# EAGLE design CH340G_CAT-TR (EAGLE 7.2.0)
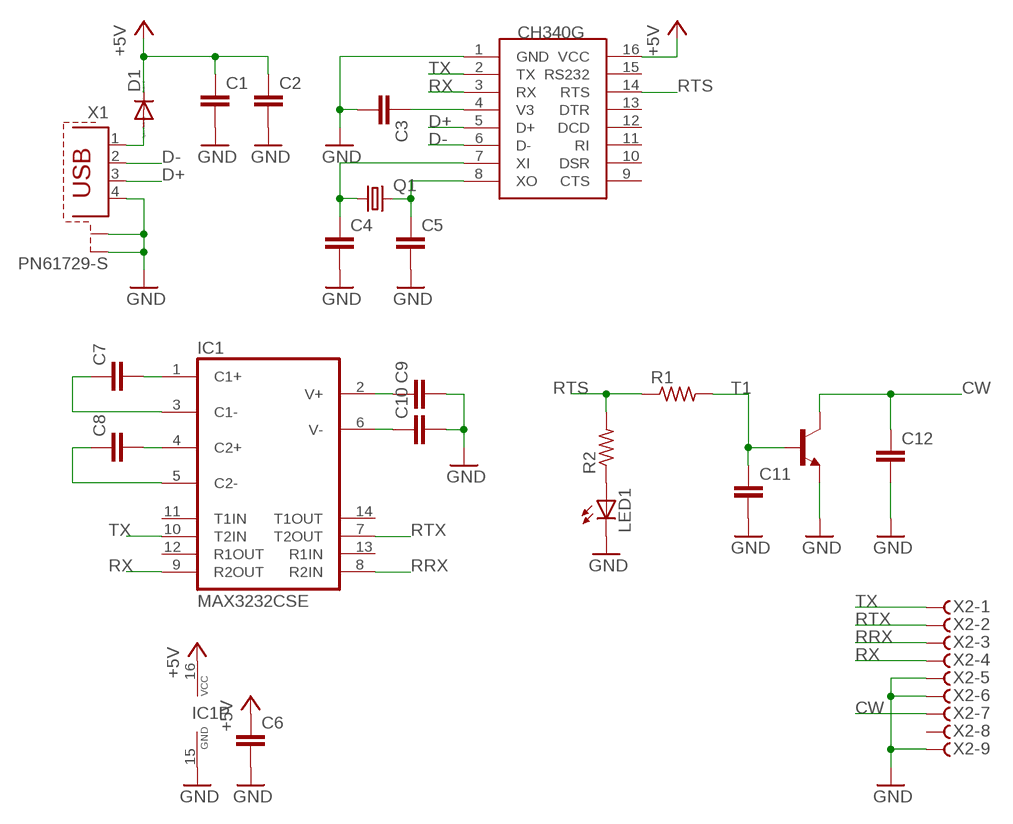
[diagram p0: schematic, sheet 1]

## Parts
C1  C-EUC0805K  [C0805K]
C2  C-EUC0805K  [C0805K]
C3  C-EUC0805K  [C0805K]
C4  C-EUC0805K  [C0805K]
C5  C-EUC0805K  [C0805K]
C6  C-EUC0805K  [C0805K]
C7  C-EUC0805K  [C0805K]
C8  C-EUC0805K  [C0805K]
C9  C-EUC0805K  [C0805K]
C10  C-EUC0805K  [C0805K]
C11  C-EUC0805K  [C0805K]
C12  C-EUC0805K  [C0805K]
D1  1N4148DO35-7  [DO35-7]
IC1  MAX3232CSE  [SO16]
LED1  LED3MM  [LED3MM]
Q1  CRYSTALHC49S  [HC49/S]
R1  R-US_M0805  [M0805]
R2  R-US_M0805  [M0805]
T1  BC548-NPN-TO92-CBE  [TO92-CBE]
U$1  CH340G  [SOIC16]
X1  PN61729-S  [PN61729-S]
X2  F09HPS  [F09HP]

## Nets
+5V: C1.1 C2.1 C6.1 D1.C IC1.16(VCC) U$1.16(VCC)
CW: C12.1 T1.C X2.7
D+: U$1.5(D+) X1.3
D-: U$1.6(D-) X1.2
GND: C1.2 C2.2 C3.2 C4.2 C5.2 C6.2 C9.2 C10.2 C11.2 C12.2 IC1.15(GND) LED1.K(C) T1.E U$1.1(GND) X1.4 X1.S1 X1.S2 X2.5 X2.6 X2.9
N$1: D1.A X1.1
N$2: C4.1 Q1.1 U$1.7(XI)
N$3: C5.1 Q1.2 U$1.8(XO)
N$4: C10.1 IC1.6(V-)
N$5: C3.1 U$1.4(V3)
N$6: C9.1 IC1.2(V+)
N$7: C8.2 IC1.4(C2+)
N$8: C7.2 IC1.1(C1+)
N$9: C7.1 IC1.3(C1-)
N$10: C8.1 IC1.5(C2-)
N$11: C11.1 R1.2 T1.B
N$12: LED1.A R2.1
RRX: IC1.8(R2IN) X2.3
RTS: R1.1 R2.2 U$1.14(RTS)
RTX: IC1.7(T2OUT) X2.2
RX: IC1.9(R2OUT) U$1.3(RX) X2.4
TX: IC1.10(T2IN) U$1.2(TX) X2.1
Unconnected: IC1.11(T1IN) IC1.12(R1OUT) IC1.13(R1IN) IC1.14(T1OUT) U$1.9(CTS) U$1.10(DSR) U$1.11(RI) U$1.12(DCD) U$1.13(DTR) U$1.15(RS232) X2.8

## Library data of the parts
C1-C12 = rcl:C-EU: CAPACITOR, European symbol
D1 = diode:1N4148: DIODE high speed (Philips)
IC1 = maxim:MAX3232*: True RS-232 Transceivers 3.0V to 5.5V, Low-Power up to 1Mbps, Using Four 0.1µF External Capacitors Source: http://pdfserv.maxim-ic.com/en/ds/MAX3222-MAX3241.pdf; MPN: MAX3232CSE; OC_FARNELL: 9725490; OC_NEWARK: 90C2890
LED1 = led:LED: LED OSRAM: - CHIPLED LG R971, LG N971, LY N971, LG Q971, LY Q971, LO R971, LY R971 LH N974, LH R974 LS Q976, LO Q976, LY Q976 LO Q996 - Hyper CHIPLED LW Q18S LB Q993, LB Q99A, LB R99A - SideLED LS A670, LO A670, LY A670, LG A670, LP A670 LB A673, LV A673, LT A673, LW A673 LH A674 LY A675 LS A676, LA A676, LO A676, LY A676, LW A676 LS A679, LY A679, LG A679 - Hyper Micro SIDELED® LS Y876, LA Y876, LO Y876, LY Y876 LT Y87S - SmartLED LW L88C, LW L88S LB L89C, LB L89S, LG L890 LS L89K, LO L89K, LY L89K LS L896, LA L896, LO L896, LY L896 - TOPLED LS T670, LO T670, LY T670, LG T670, LP T670 LSG T670, LSP T670, LSY T670, LOP T670, LYG T670 LG T671, LOG T671, LSG T671 LB T673, LV T673, LT T673, LW T673 LH T674 LS T676, LA T676, LO T676, LY T676, LB T676, LH T676, LSB T676, LW T676 LB T67C, LV T67C, LT T67C, LS T67K, LO T67K, LY T67K, LW E67C LS E67B, LA E67B, LO E67B, LY E67B, LB E67C, LV E67C, LT E67C LW T67C LS T679, LY T679, LG T679 LS T770, LO T770, LY T770, LG T770, LP T770 LB T773, LV T773, LT T773, LW T773 LH T774 LS E675, LA E675, LY E675, LS T675 LS T776, LA T776, LO T776, LY T776, LB T776 LHGB T686 LT T68C, LB T68C - Hyper Mini TOPLED® LB M676 - Mini TOPLED Santana® LG M470 LS M47K, LO M47K, LY M47K Source: http://www.osram.convergy.de LUXEON: - LUMILED® LXK2-PW12-R00, LXK2-PW12-S00, LXK2-PW14-U00, LXK2-PW14-V00 LXK2-PM12-R00, LXK2-PM12-S00, LXK2-PM14-U00 LXK2-PE12-Q00, LXK2-PE12-R00, LXK2-PE12-S00, LXK2-PE14-T00, LXK2-PE14-U00 LXK2-PB12-K00, LXK2-PB12-L00, LXK2-PB12-M00, LXK2-PB14-N00, LXK2-PB14-P00, LXK2-PB14-Q00 LXK2-PR12-L00, LXK2-PR12-M00, LXK2-PR14-Q00, LXK2-PR14-R00 LXK2-PD12-Q00, LXK2-PD12-R00, LXK2-PD12-S00 LXK2-PH12-R00, LXK2-PH12-S00 LXK2-PL12-P00, LXK2-PL12-Q00, LXK2-PL12-R00 Source: www.luxeon.com KINGBRIGHT: KA-3528ASYC Source: www.kingbright.com
Q1 = crystal:CRYSTAL: CRYSTAL; OC_FARNELL: 1667008; OC_NEWARK: unknown
R1 R2 = rcl:R-US_: RESISTOR, American symbol
T1 = transistor:*-NPN-: NPN Transistror BF959 corrected 2008.03.06
U$1 = ch340g:CH340G
X1 = con-berg:PN61729-S: BERG USB connector; OC_FARNELL: unknown; OC_NEWARK: unknown
X2 = con-subd:F09?S: SUB-D; OC_FARNELL: unknown; OC_NEWARK: unknown

## Board
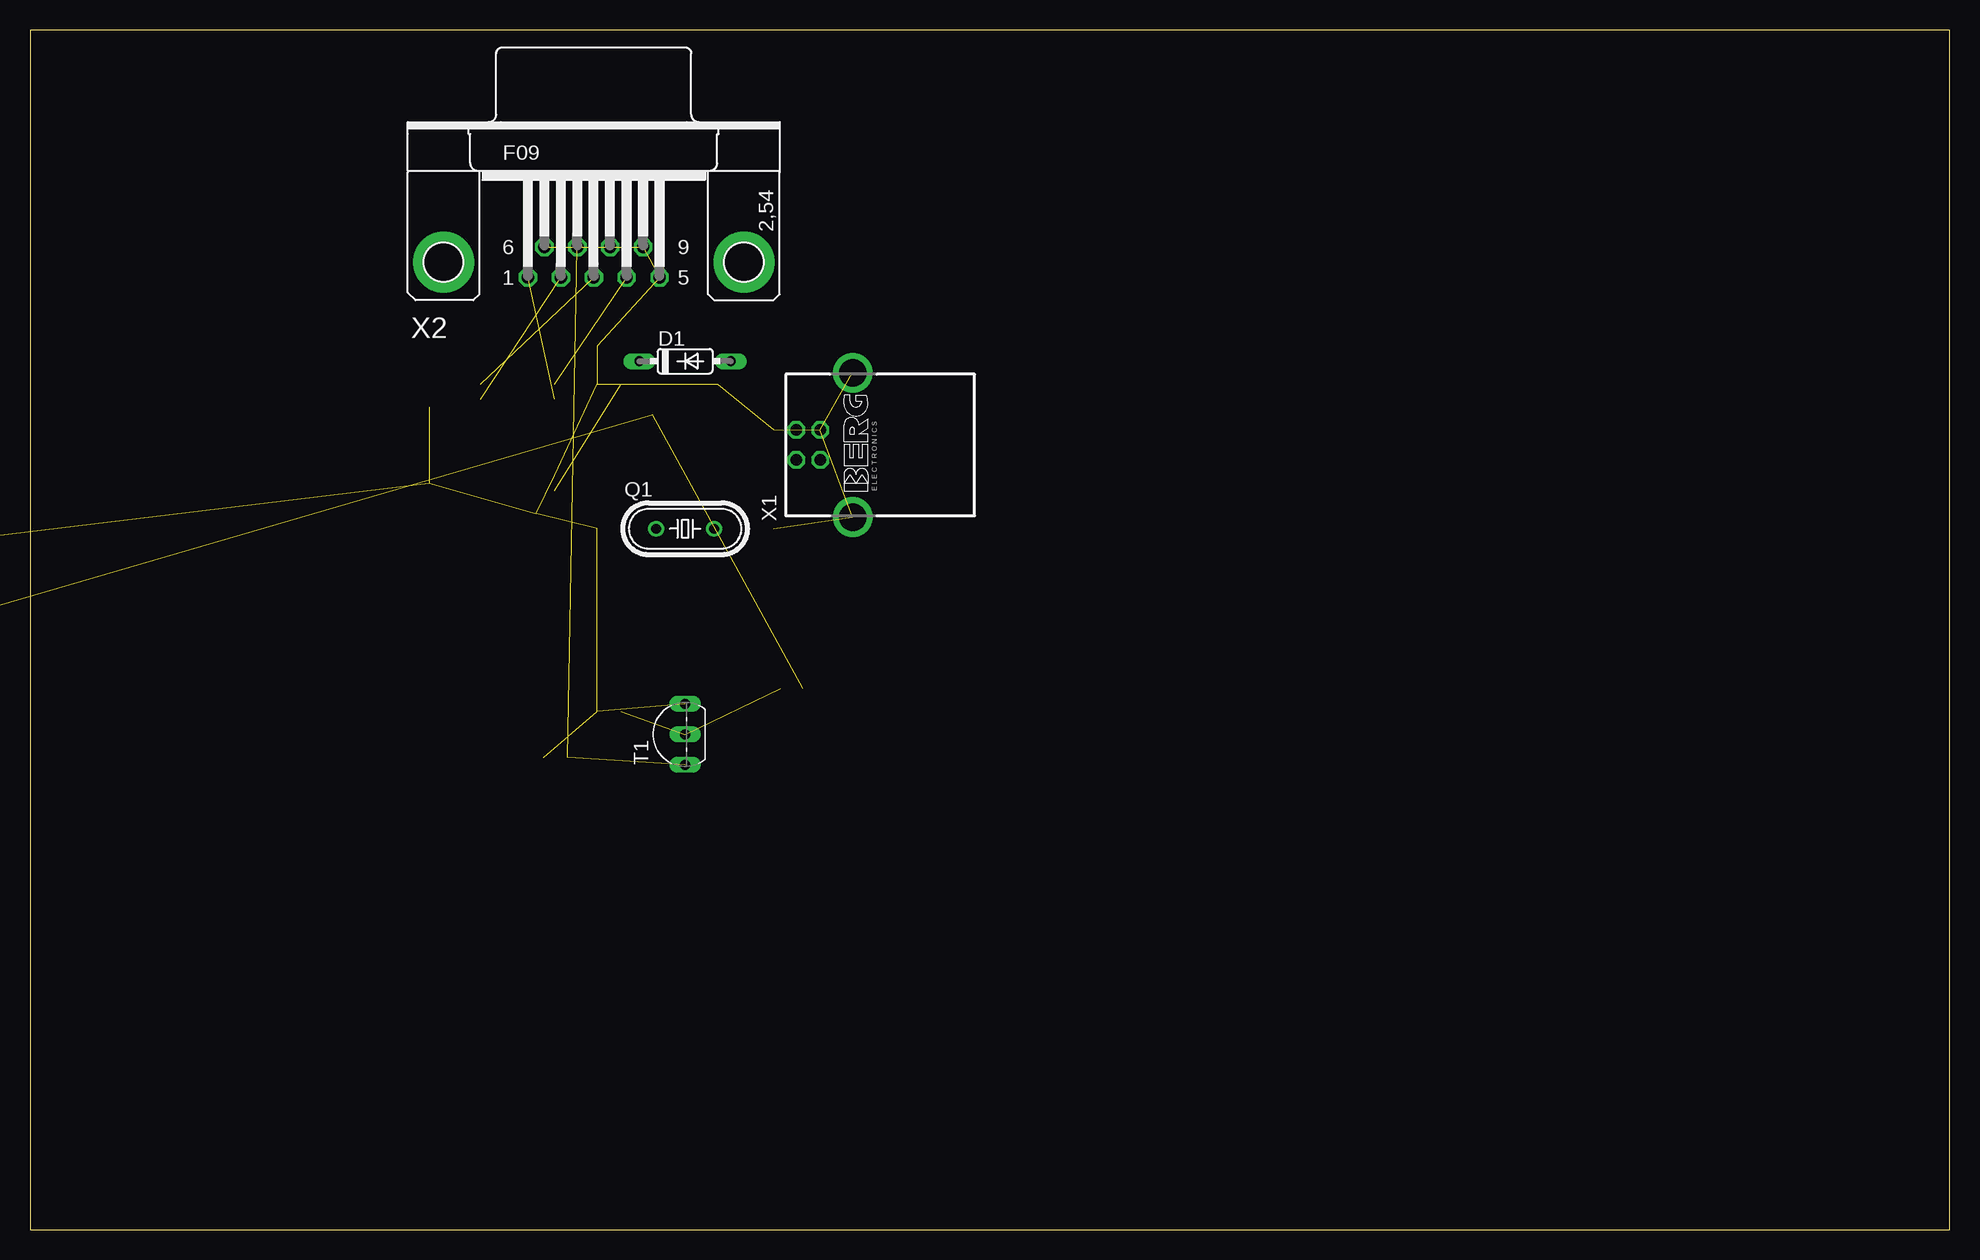
[diagram p1: board, top side]
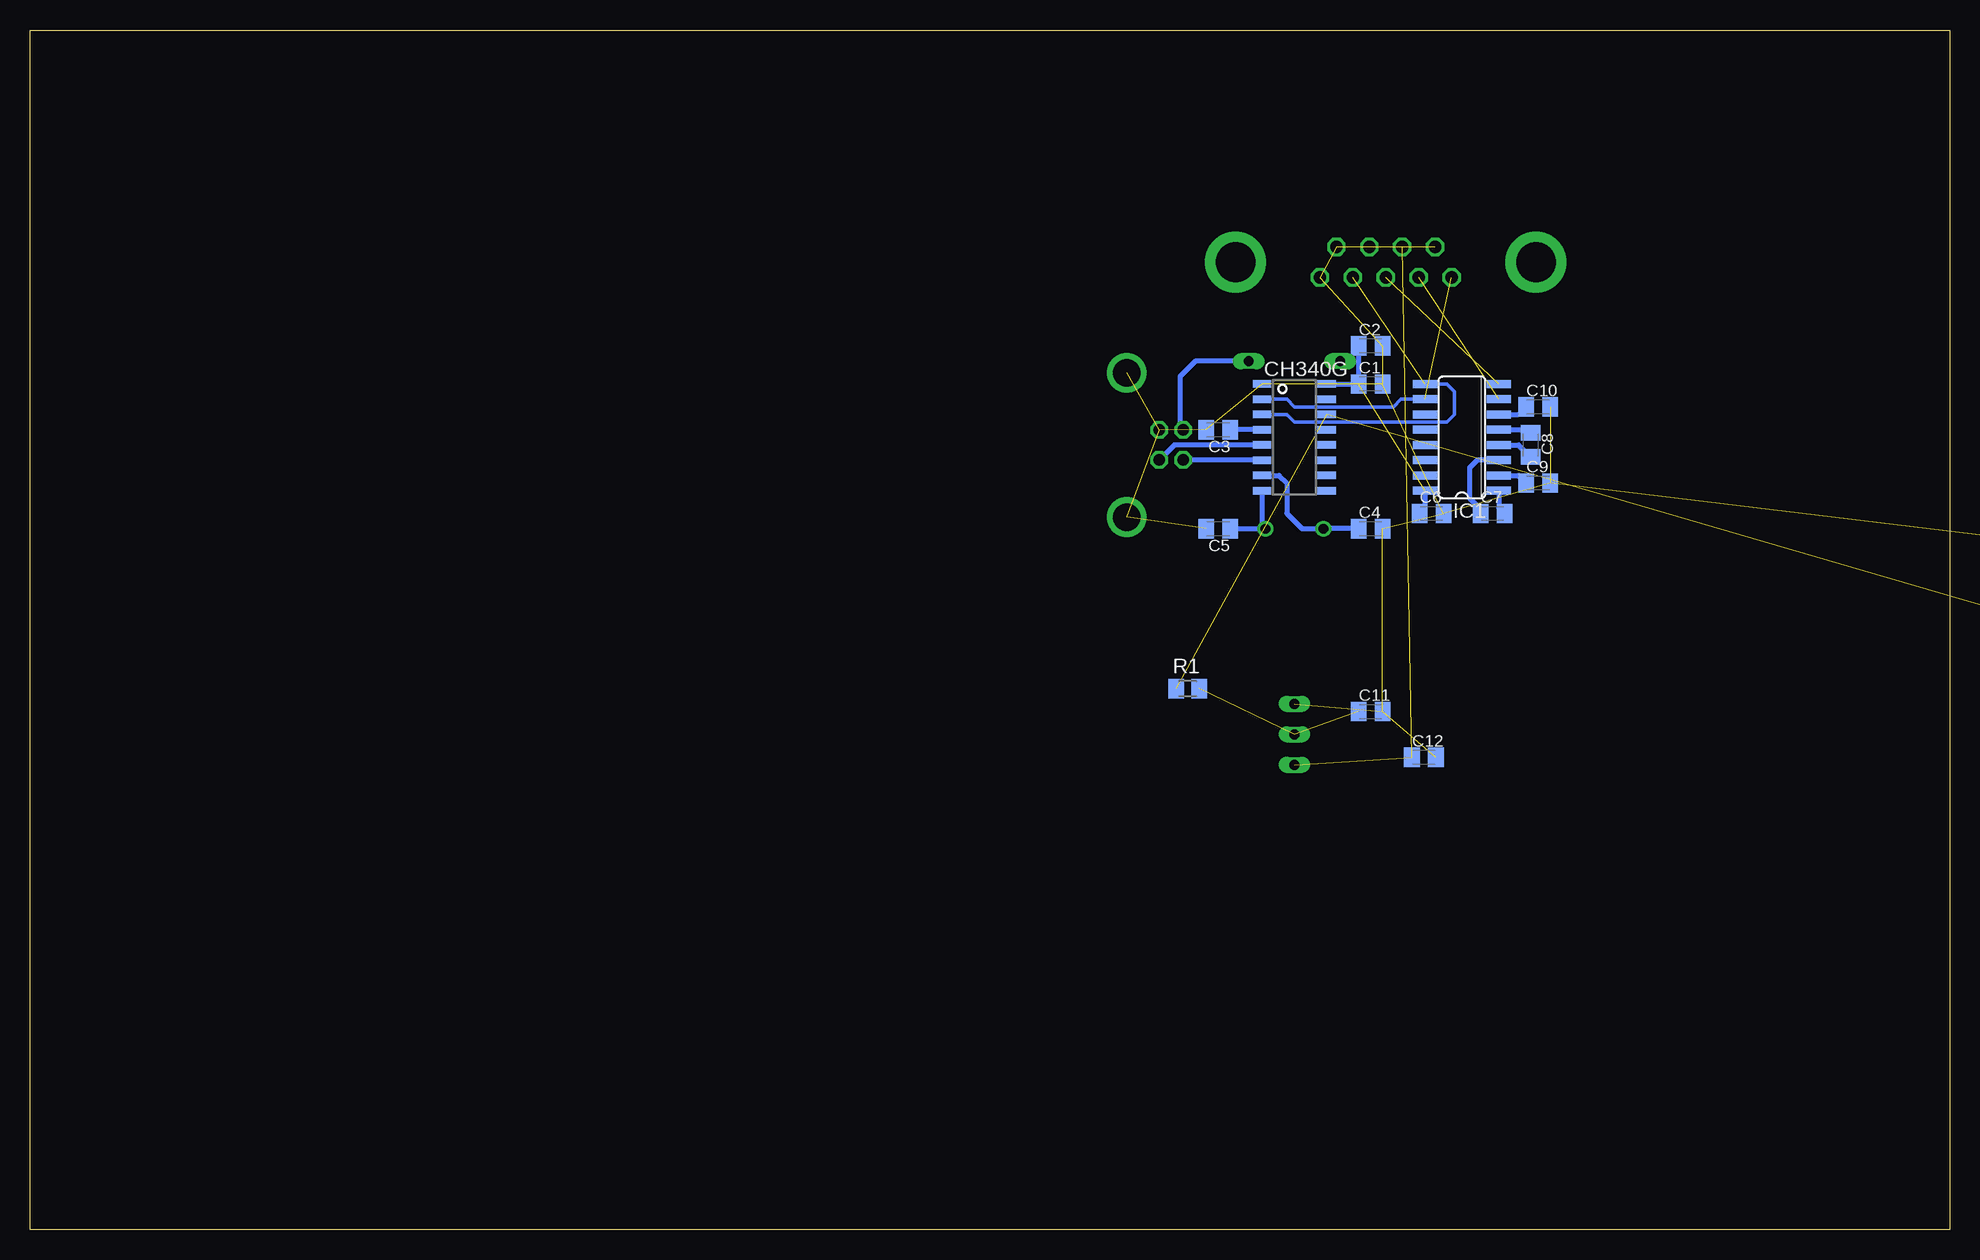
[diagram p2: board, bottom side, seen from below]

Size 160 x 100 mm. Coordinates in mm from the lower left corner, seen from the top.
Outline: 0,0 160,0 160,100 0,100 0,0
Copper layers (1*16): Top 0.035mm / dielectric 1.5mm / Bottom 0.035mm
Design rules "default": minimum track width 10mil, minimum drill 24mil, track to track 8mil, track to pad 8mil, pad to pad 8mil, via to via 8mil, smd to smd 8mil, copper to edge 40mil, drill to drill 8mil, minimum pad ring 10mil, minimum via ring 8mil, stop-mask expansion 4mil, vias tented up to drill 0mil, thermal gap 10mil

### Footprints (pad centres in the part's own frame; a part is rotated, then mirrored left to right if it is on the bottom)
C0805K = smd 1.3 x 1.6: 1 -1,0; 2 1,0
DO35-7 = drill 0.813 long: A 3.81,0; C -3.81,0
SO16 = smd 0.66 x 2.032: 1 -4.445,-3.073; 2 -3.175,-3.073; 3 -1.905,-3.073; 4 -0.635,-3.073; 5 0.635,-3.073; 6 1.905,-3.073; 7 3.175,-3.073; 8 4.445,-3.073; 9 4.445,3.073; 10 3.175,3.073; 11 1.905,3.073; 12 0.635,3.073; 13 -0.635,3.073; 14 -1.905,3.073; 15 -3.175,3.073; 16 -4.445,3.073
LED3MM = drill 0.813 octagon: A -1.27,0; K 1.27,0
HC49/S = drill 0.813: 1 -2.413,0; 2 2.413,0
M0805 = smd 1.3 x 1.6: 1 -0.95,0; 2 0.95,0
TO92-CBE = drill 0.813 long: B 0,0; C -2.54,0; E 2.54,0
SOIC16 = smd 0.635 x 1.524: 1 -4.445,-2.695; 2 -3.175,-2.695; 3 -1.905,-2.695; 4 -0.635,-2.695; 5 0.635,-2.695; 6 1.905,-2.695; 7 3.175,-2.695; 8 4.445,-2.695; 9 4.445,2.695; 10 3.175,2.695; 11 1.905,2.695; 12 0.635,2.695; 13 -0.635,2.695; 14 -1.905,2.695; 15 -3.175,2.695; 16 -4.445,2.695
PN61729-S = drill 0.95 octagon: 1 1.25,4.71; 2 -1.25,4.71; 3 -1.25,2.71; 4 1.25,2.71 | drill 2.3 pad 2.9: S1 -6.02,0; S2 6.02,0
F09HP = drill 1.016 octagon: 1 -5.486,-1.27; 2 -2.743,-1.27; 3 0,-1.27; 4 2.743,-1.27; 5 5.486,-1.27; 6 -4.115,1.27; 7 -1.372,1.27; 8 1.372,1.27; 9 4.115,1.27 | drill 3.302 pad 5.08: G1 -12.522,0; G2 12.522,0

### Placement (x,y rotation side)
C1  48.26,70.48 0 bottom
C2  48.26,73.66 0 bottom
C3  60.96,66.67 180 bottom
C4  48.26,58.42 0 bottom
C5  60.96,58.42 180 bottom
C6  43.18,59.69 0 bottom
C7  38.1,59.69 0 bottom
C8  34.92,65.41 270 bottom
C9  34.29,62.23 0 bottom
C10  34.29,68.58 0 bottom
C11  48.26,43.18 0 bottom
C12  43.81,39.37 0 bottom
D1  54.61,72.39 0 top
IC1  40.64,66.04 90 bottom
LED1  -20.32,55.88 0 top  (outside the outline)
Q1  54.61,58.42 0 top
R1  63.5,45.09 0 bottom
R2  -19.05,46.99 0 bottom  (outside the outline)
T1  54.61,41.27 90 top
U$1  54.61,66.04 270 bottom
X1  68.58,65.41 90 top
X2  46.99,80.64 0 top

### Tracks (layer width: path | path; a pad name or v marks a point on that pad's centre or on a via)
+5V  (1 unrouted)
  Bottom 0.406: U$1.16 C1.1 49.26,72.39 | C2.1 49.26,72.39 | D1.C 49.26,72.39 | IC1.16 43.71,60.16 C6.1
CW  (2 unrouted)
D+
  Bottom 0.406: U$1.5 64.62,65.41 X1.3
D-
  Bottom 0.406: U$1.6 63.85,64.14 X1.2
GND  (19 unrouted)
N$1
  Bottom 0.406: D1.A 62.87,72.39 64.14,71.12 64.14,66.92 X1.1
N$2
  Bottom 0.406: C4.1 Q1.1 53.98,58.42 55.24,59.69 55.24,62.23 55.88,62.87 U$1.7
N$3
  Bottom 0.406: C5.1 Q1.2 57.3,58.7 U$1.8
N$4
  Bottom 0.406: IC1.6 35.92,67.94 C10.1
N$5
  Bottom 0.406: U$1.4 C3.1
N$6
  Bottom 0.406: IC1.2 35.92,62.87 C9.1
N$7
  Bottom 0.406: IC1.4 35.92,65.41 C8.2
N$8
  Bottom 0.406: IC1.1 37.57,60.16 C7.2
N$9
  Bottom 0.406: IC1.3 39.37,64.14 40.01,63.5 40.01,60.96 39.37,60.33 39.37,59.96 C7.1
N$10
  Bottom 0.406: IC1.5 35.2,66.67 C8.1
N$11  (2 unrouted)
N$12  (1 unrouted)
RRX  (1 unrouted)
RTS  (2 unrouted)
RTX  (1 unrouted)
RX  (1 unrouted)
  Bottom 0.305: U$1.3 55.24,67.94 54.61,67.31 41.91,67.31 41.27,67.94 41.27,69.85 41.91,70.48 IC1.9
TX  (1 unrouted)
  Bottom 0.305: U$1.2 55.24,69.22 54.61,68.58 46.35,68.58 45.72,69.22 IC1.10